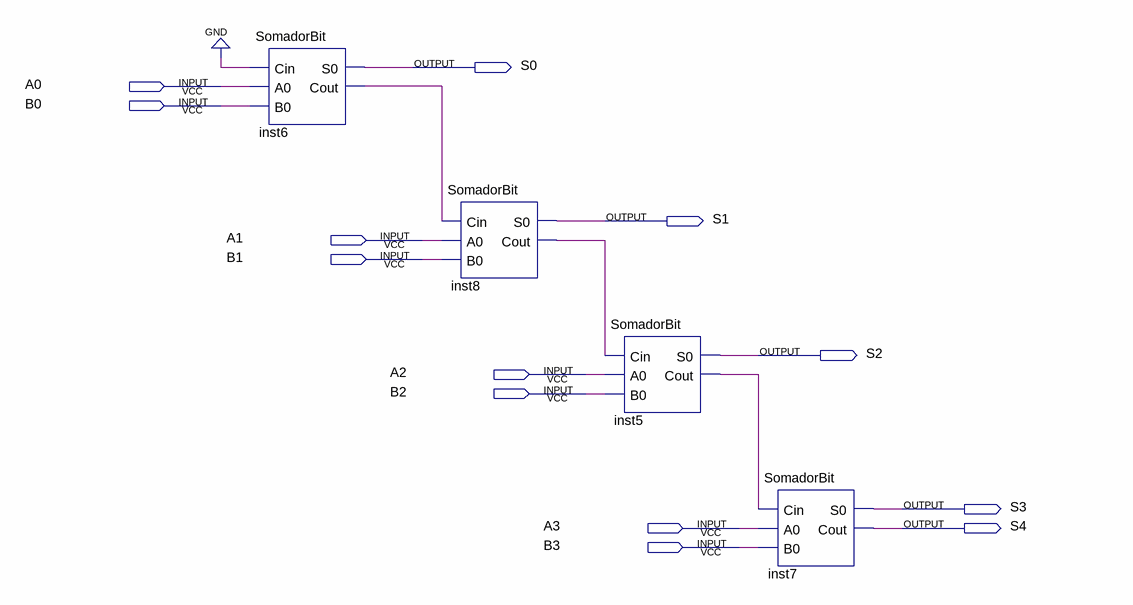
[diagram p0: schematic sheet]
// Quartus schematic Somador4bits.bdf as structural Verilog: 4 symbols, 13 pins
module Somador4bits (
  input  A0,
  input  B0,
  input  A1,
  input  B1,
  input  A2,
  input  B2,
  input  A3,
  input  B3,
  output S0,
  output S1,
  output S2,
  output S3,
  output S4
);

  wire inst5_cout, inst6_cout, inst8_cout;

  SomadorBit inst6 (.Cin(1'b0), .A0(A0), .B0(B0), .S0(S0), .Cout(inst6_cout));
  SomadorBit inst8 (.Cin(inst6_cout), .A0(A1), .B0(B1), .S0(S1), .Cout(inst8_cout));
  SomadorBit inst5 (.Cin(inst8_cout), .A0(A2), .B0(B2), .S0(S2), .Cout(inst5_cout));
  SomadorBit inst7 (.Cin(inst5_cout), .A0(A3), .B0(B3), .S0(S3), .Cout(S4));
endmodule
